# EAGLE design ADS7947 Breakout (EAGLE 9.6.2)
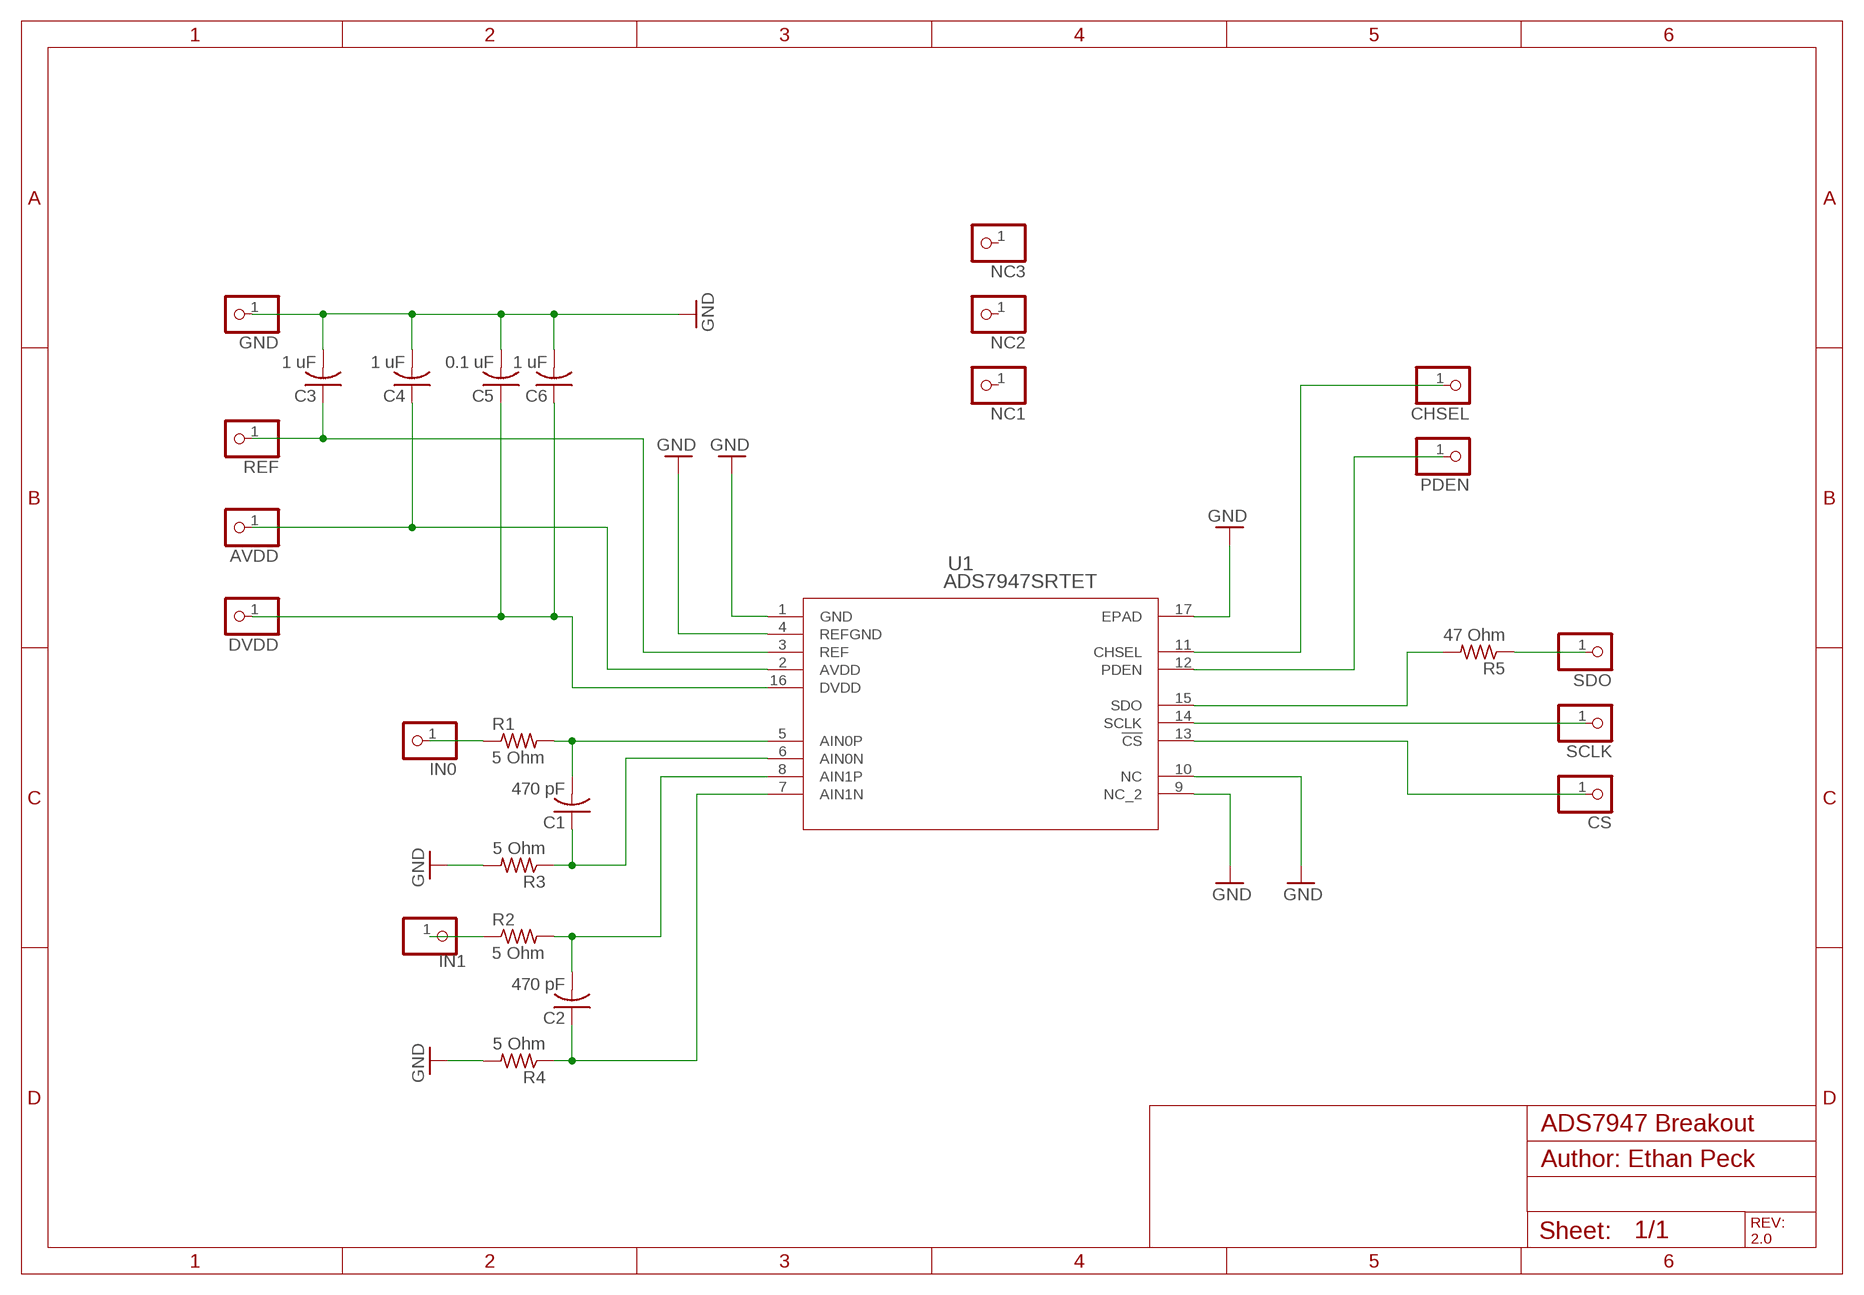
[diagram p0: schematic, sheet 1]

## Parts
AVDD  PINHD-1X1  [1X01]
C1  470 pF  C-USC0805  [C0805]
C2  470 pF  C-USC0805  [C0805]
C3  1 uF  C-USC0805  [C0805]
C4  1 uF  C-USC0805  [C0805]
C5  0.1 uF  C-USC0805  [C0805]
C6  1 uF  C-USC0805  [C0805]
CHSEL  PINHD-1X1  [1X01]
CS  PINHD-1X1  [1X01]
DVDD  PINHD-1X1  [1X01]
GND  PINHD-1X1  [1X01]
IN0  PINHD-1X1  [1X01]
IN1  PINHD-1X1  [1X01]
NC1  PINHD-1X1  [1X01]
NC2  PINHD-1X1  [1X01]
NC3  PINHD-1X1  [1X01]
PDEN  PINHD-1X1  [1X01]
R1  5 Ohm  R-US_R0805  [R0805]
R2  5 Ohm  R-US_R0805  [R0805]
R3  5 Ohm  R-US_R0805  [R0805]
R4  5 Ohm  R-US_R0805  [R0805]
R5  47 Ohm  R-US_R0805  [R0805]
REF  PINHD-1X1  [1X01]
SCLK  PINHD-1X1  [1X01]
SDO  PINHD-1X1  [1X01]
U1  ADS7947SRTET  [RTE16_1P7X1P7]

## Nets
AIN0N [AIN0N]: C1.1 R3.1 U1.6(AIN0N)
AIN0P [AIN0P]: C1.2 R1.2 U1.5(AIN0P)
AIN1N [AIN1N]: C2.1 R4.1 U1.7(AIN1N)
AIN1P [AIN1P]: C2.2 R2.2 U1.8(AIN1P)
AVDD [AVDD]: AVDD.1 C4.1 U1.2(AVDD)
CHSEL [CHSEL]: CHSEL.1 U1.11(CHSEL)
CS [CS]: CS.1 U1.13(!CS)
DVDD [DVDD]: C5.1 C6.1 DVDD.1 U1.16(DVDD)
GND [GND]: C3.2 C4.2 C5.2 C6.2 GND.1 R3.2 R4.2 U1.1(GND) U1.4(REFGND) U1.9(NC_2) U1.10(NC) U1.17(EPAD)
IN0 [AIN0P]: IN0.1 R1.1
IN1: IN1.1 R2.1
N$1 [SDO]: R5.1 SDO.1
PDEN [PDEN]: PDEN.1 U1.12(PDEN)
REF [REF]: C3.1 REF.1 U1.3(REF)
SCLK [SCLK]: SCLK.1 U1.14(SCLK)
SDO [SDO]: R5.2 U1.15(SDO)
Unconnected: NC1.1 NC2.1 NC3.1

## Notes on the sheet
- Author: Ethan Peck
- REV: 
  2.0

## Library data of the parts
AVDD CHSEL CS DVDD GND IN0 IN1 NC1-NC3 PDEN REF SCLK SDO = pinhead:PINHD-1X1: PIN HEADER
C1-C6 = rcl:C-US: CAPACITOR, American symbol; SPICEPREFIX: C
R1-R5 = rcl:R-US_: RESISTOR, American symbol; SPICEPREFIX: R
U1 = ADS7947:ADS7947SRTET: ADS7947 12 Bit ADC; DATASHEET_URL: http://www.ti.com/lit/gpn/ADS7947; DESCRIPTION: 12-Bit, 2 MSPS, Dual Channel, Pseudo-differential uPower Serial SAR ADC; FAMILY_NAME: PRECISION ADC (<=10MSPS); GENERIC_PART_NUMBER: ADS7947; INDUSTRY_STD_PKG_TYPE: WQFN; MANUFACTURER: Texas Instruments; PACKAGE_DESIGNATOR: RTE; PIN_COUNT: 16

## Board
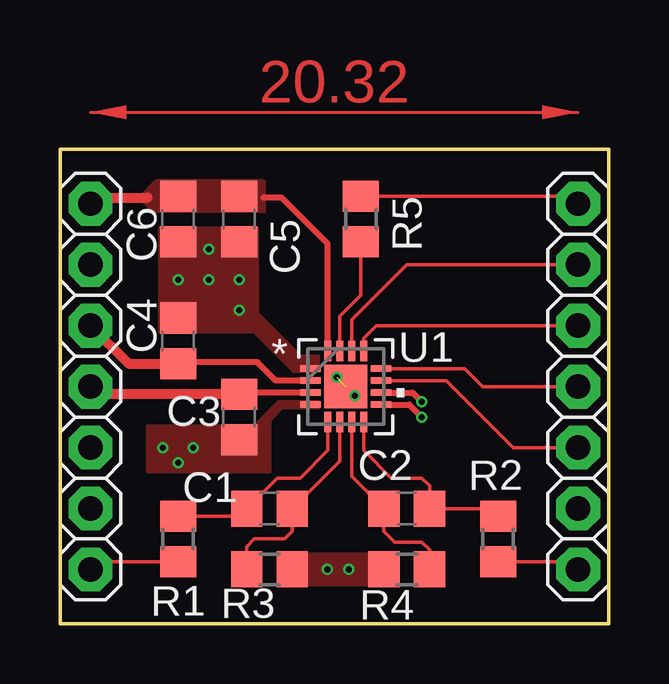
[diagram p1: board, top side]
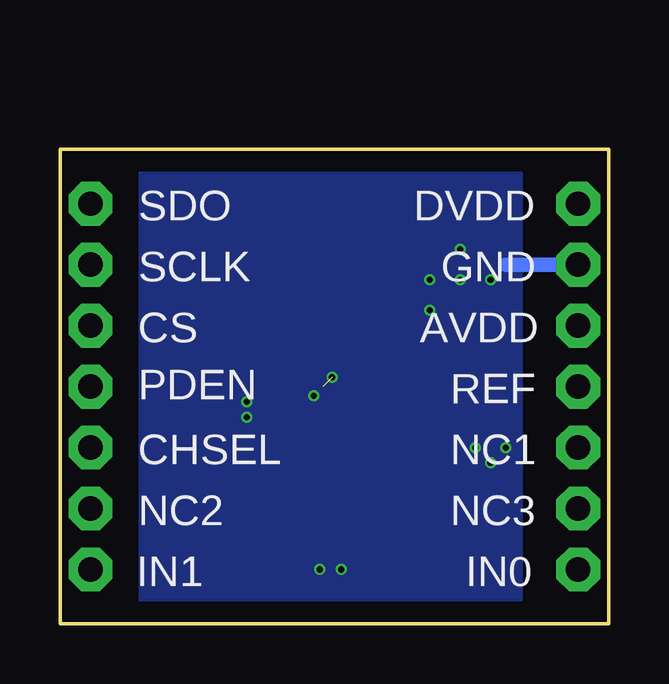
[diagram p2: board, bottom side, seen from below]

Size 22.86 x 19.78 mm. Coordinates in mm from the lower left corner, seen from the top.
Outline: 0,0 22.86,0 22.86,19.78 0,19.78 0,0
Copper layers (1*16): Top 0.035mm / dielectric 1.6mm / Bottom 0.035mm
Design rules "MacrofabStandard": minimum track width 5mil, minimum drill 10mil, track to track 5mil, track to pad 5mil, pad to pad 5mil, via to via 5mil, smd to smd 5mil, copper to edge 10mil, drill to drill 6mil, minimum pad ring 10mil, minimum via ring 4mil, stop-mask expansion 5mil, vias tented up to drill 0mil, thermal gap 10mil

### Footprints (pad centres in the part's own frame; a part is rotated, then mirrored left to right if it is on the bottom)
1X01 = drill 1.016 octagon: 1 0,0
C0805 = smd 1.3 x 1.5: 1 -0.95,0; 2 0.95,0
R0805 = smd 1.3 x 1.5: 1 -0.95,0; 2 0.95,0
RTE16_1P7X1P7 = smd 0.85 x 0.28: 1 -1.475,0.75; 2 -1.475,0.25; 3 -1.475,-0.25; 4 -1.475,-0.75; 9 1.475,-0.75; 10 1.475,-0.25; 11 1.475,0.25; 12 1.475,0.75 | smd 0.28 x 0.85: 5 -0.75,-1.475; 6 -0.25,-1.475; 7 0.25,-1.475; 8 0.75,-1.475; 13 0.75,1.475; 14 0.25,1.475; 15 -0.25,1.475; 16 -0.75,1.475 | smd 1.803 x 1.803: 17 0,0

### Placement (x,y rotation side)
AVDD  1.27,12.43 0 top
C1  8.73,4.81 180 top
C2  14.45,4.81 0 top
C3  7.46,8.62 270 top
C4  4.92,11.79 90 top
C5  7.46,16.88 270 top
C6  4.92,16.88 270 top
CHSEL  21.59,7.35 0 top
CS  21.59,12.43 0 top
DVDD  1.27,17.51 0 top
GND  1.27,14.97 0 top
IN0  1.27,2.27 0 top
IN1  21.59,2.27 0 top
NC1  1.27,7.35 0 top
NC2  21.59,4.81 0 top
NC3  1.27,4.81 0 top
PDEN  21.59,9.89 0 top
R1  4.92,3.54 90 top
R2  18.26,3.54 90 top
R3  8.73,2.27 0 top
R4  14.45,2.27 180 top
R5  12.54,16.88 270 top
REF  1.27,9.89 0 top
SCLK  21.59,14.97 0 top
SDO  21.59,17.51 0 top
U1  11.91,9.89 0 top

### Tracks (layer width: path | path; a pad name or v marks a point on that pad's centre or on a via)
AIN0N
  Top 0.152: U1.6 11.66,6.79 C1.1 9.68,3.85 9.37,3.54 8.1,3.54 7.78,3.23 R3.1
AIN0P
  Top 0.152: U1.5 11.16,7.23 10,6.08 9.05,6.08 C1.2 7.46,4.49 R1.2
AIN1N
  Top 0.152: U1.7 12.16,6.15 C2.1 13.5,3.85 13.94,3.41 15.08,3.41 15.4,3.1 R4.1
AIN1P
  Top 0.152: U1.8 12.66,7.23 13.81,6.08 15.08,6.08 15.4,5.77 C2.2 17.94,4.81 R2.2
AVDD
  Top 0.254: U1.2 8.99,10.14 8.22,10.91 4.98,10.91 C4.1
  Top 0.406: AVDD.1 2.86,10.85 C4.1
CHSEL
  Top 0.152: U1.11 16.1,10.14 18.89,7.35 CHSEL.1
CS
  Top 0.152: U1.13 12.66,11.91 13.18,12.43 CS.1
DVDD
  Top 0.254: U1.16 11.16,15.85 9.24,17.76 8.48,17.76
  Top 0.406: DVDD.1 1.52,17.76 3.65,17.76
  pour Top (no thermals): 8.48,17.26 8.48,18.4 4.03,18.4 3.4,17.76 3.91,17.26
GND  (via drill 0.25)  (1 unrouted)
  Top 0.254: U1.9 14.56,9.14 v15.08,8.62 | U1.10 14.7,9.64 v15.08,9.26
  Bottom 0.61: GND.1 4.29,14.97
  other vias: 4.29,7.35 5.56,7.35 4.92,6.71 7.46,14.34 6.19,14.34 7.46,13.07 4.92,14.34 6.19,15.61 11.14,2.27 12.03,2.27 11.53,10.27 12.29,9.51
  pour Top (no thermals): 10.76,9.26 9.11,9.26 8.1,8.24 3.65,8.24 3.65,6.33 8.73,6.33 8.73,8.49 9.24,9 10.76,9
  pour Top (no thermals): 10.76,10.53 10.76,11.16 10,11.16 8.22,12.94 8.22,16.49 4.16,16.49 4.16,12.18 8.1,12.18 9.75,10.53
  pour Top (no thermals): 9.11,2.9 14.07,2.9 14.07,1.64 9.11,1.64
  pour Bottom (no thermals): 3.65,18.78 19.53,18.78 19.53,1 3.65,1
IN0
  Top 0.152: R1.1 1.59,2.59 IN0.1
IN1
  Top 0.152: R2.1 21.27,2.59 IN1.1
N$1
  Top 0.152: R5.1 21.28,17.82 SDO.1
PDEN
  Top 0.152: U1.12 16.87,10.64 17.62,9.89 PDEN.1
REF
  Top 0.254: U1.3 7.53,9.64 C3.1
  Top 0.406: C3.1 1.59,9.57 REF.1
SCLK
  Top 0.152: U1.14 12.16,12.68 14.45,14.97 SCLK.1
SDO
  Top 0.152: U1.15 11.66,12.82 12.54,13.7 R5.2
(copper drawn outside any net)
  shapes: Top area x1